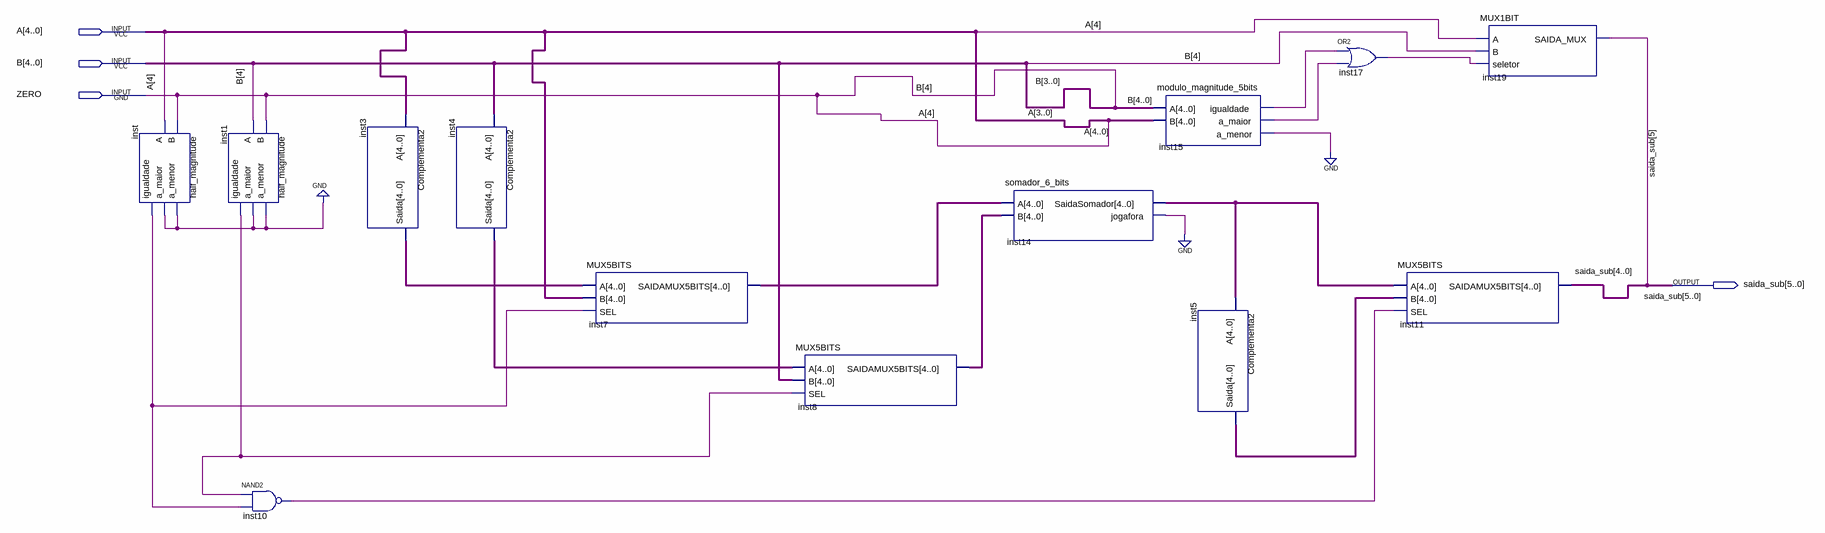
[diagram p0: schematic sheet]
// Quartus schematic modulo_subtrator.bdf as structural Verilog: 13 symbols, 4 pins
module modulo_subtrator (
  input  [4:0] A,
  input  [4:0] B,
  input  ZERO,
  output [5:0] saida_sub
);

  wire inst1_igualdade, inst10_out, inst14_jogafora, inst15_a_maior, inst15_a_menor, inst15_igualdade,
       inst17_out, inst_a_menor, inst_igualdade;
  wire [4:0] inst3_saida, inst4_saida, inst5_saida, inst7_saidamux5bits, inst8_saidamux5bits,
       inst14_saidasomador;

  half_magnitude inst (.B(A[4]), .A(A[4]), .a_menor(inst_a_menor), .a_maior(inst_a_menor), .igualdade(inst_igualdade));
  half_magnitude inst1 (
    .B(A[4]), .A(A[4]), .a_menor(inst_a_menor), .a_maior(inst_a_menor), .igualdade(inst1_igualdade));
  nand inst10 (inst10_out, inst1_igualdade, inst_igualdade);
  Complementa2 inst3 (.A(A), .Saida(inst3_saida));
  Complementa2 inst4 (.A({A[4], B[3:0]}), .Saida(inst4_saida));
  MUX5BITS inst7 (.A(inst3_saida), .B(A), .SEL(inst_igualdade), .SAIDAMUX5BITS(inst7_saidamux5bits));
  MUX5BITS inst8 (.A(inst4_saida), .B({A[4], B[3:0]}), .SEL(inst1_igualdade), .SAIDAMUX5BITS(inst8_saidamux5bits));
  somador_6_bits inst14 (
    .A(inst7_saidamux5bits), .B(inst8_saidamux5bits), .SaidaSomador(inst14_saidasomador),
    .jogafora(inst14_jogafora));
  modulo_magnitude_5bits inst15 (
    .A({A[4], B[3:0]}), .B(A), .igualdade(inst15_igualdade), .a_maior(inst15_a_maior),
    .a_menor(inst15_a_menor));
  Complementa2 inst5 (.A(inst14_saidasomador), .Saida(inst5_saida));
  or inst17 (inst17_out, inst15_igualdade, inst15_a_maior);
  MUX5BITS inst11 (.A(inst14_saidasomador), .B(inst5_saida), .SEL(inst10_out), .SAIDAMUX5BITS(saida_sub[4:0]));
  MUX1BIT inst19 (.A(A[4]), .B(A[4]), .seletor(inst17_out), .SAIDA_MUX(saida_sub[5]));

  assign B[4] = A[4];
  assign ZERO = A[4];
  // also tied to GND on the sheet: {inst_a_menor, inst14_jogafora, inst15_a_menor}
endmodule
